# Altium schematic sheet Connector - Carrier.SchDoc
size A4; SheetNumber: 8; SheetTotal: 8
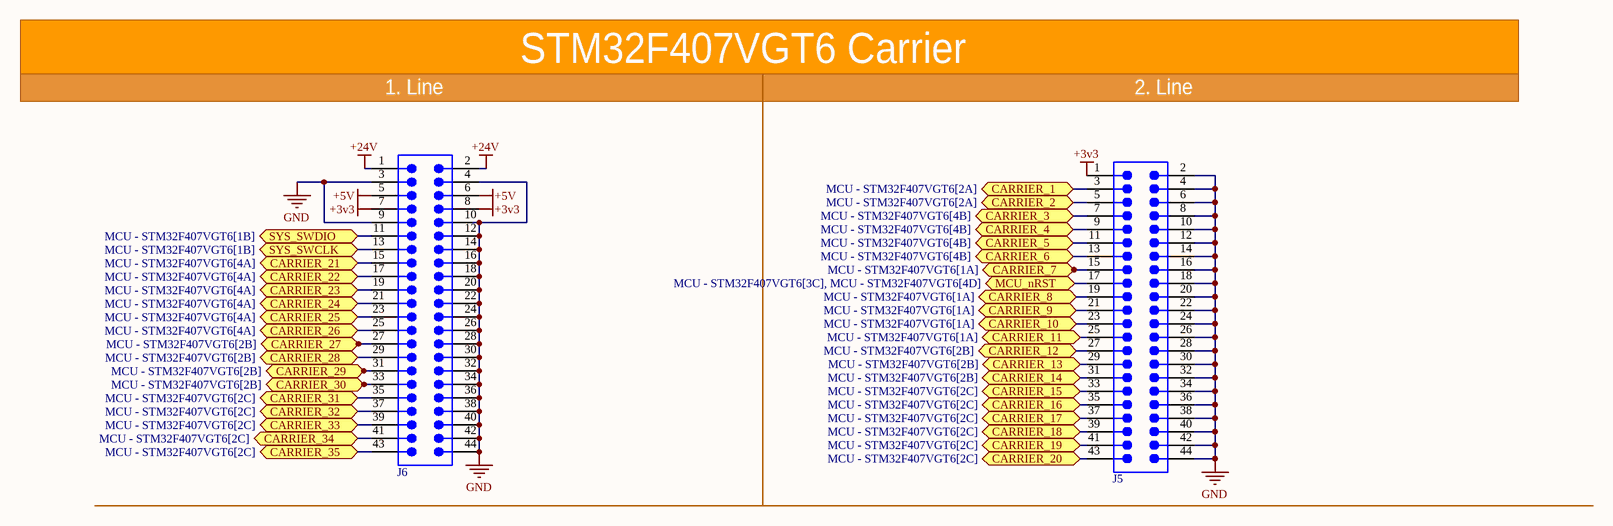
[diagram p0: Connector - Carrier.SchDoc]

## Parts
J5  62004421121  [62004421121]  (value not drawn)
J6  62004421121  [62004421121]  (value not drawn)

## Ports
CARRIER_1 (bidir, see MCU - STM32F407VGT6[2A]), CARRIER_2 (bidir, see MCU - STM32F407VGT6[2A]), CARRIER_3 (bidir, see MCU - STM32F407VGT6[4B]), CARRIER_4 (bidir, see MCU - STM32F407VGT6[4B]), CARRIER_5 (bidir, see MCU - STM32F407VGT6[4B]), CARRIER_6 (bidir, see MCU - STM32F407VGT6[4B]), CARRIER_7 (bidir, see MCU - STM32F407VGT6[1A]), CARRIER_8 (bidir, see MCU - STM32F407VGT6[1A]), CARRIER_9 (bidir, see MCU - STM32F407VGT6[1A]), CARRIER_10 (bidir, see MCU - STM32F407VGT6[1A]), CARRIER_11 (bidir, see MCU - STM32F407VGT6[1A]), CARRIER_12 (bidir, see MCU - STM32F407VGT6[2B]), CARRIER_13 (bidir, see MCU - STM32F407VGT6[2B]), CARRIER_14 (bidir, see MCU - STM32F407VGT6[2B]), CARRIER_15 (bidir, see MCU - STM32F407VGT6[2C]), CARRIER_16 (bidir, see MCU - STM32F407VGT6[2C]), CARRIER_17 (bidir, see MCU - STM32F407VGT6[2C]), CARRIER_18 (bidir, see MCU - STM32F407VGT6[2C]), CARRIER_19 (bidir, see MCU - STM32F407VGT6[2C]), CARRIER_20 (bidir, see MCU - STM32F407VGT6[2C]), CARRIER_21 (bidir, see MCU - STM32F407VGT6[4A]), CARRIER_22 (bidir, see MCU - STM32F407VGT6[4A]), CARRIER_23 (bidir, see MCU - STM32F407VGT6[4A]), CARRIER_24 (bidir, see MCU - STM32F407VGT6[4A]), CARRIER_25 (bidir, see MCU - STM32F407VGT6[4A]), CARRIER_26 (bidir, see MCU - STM32F407VGT6[4A]), CARRIER_27 (bidir, see MCU - STM32F407VGT6[2B]), CARRIER_28 (bidir, see MCU - STM32F407VGT6[2B]), CARRIER_29 (bidir, see MCU - STM32F407VGT6[2B]), CARRIER_30 (bidir, see MCU - STM32F407VGT6[2B]), CARRIER_31 (bidir, see MCU - STM32F407VGT6[2C]), CARRIER_32 (bidir, see MCU - STM32F407VGT6[2C]), CARRIER_33 (bidir, see MCU - STM32F407VGT6[2C]), CARRIER_34 (bidir, see MCU - STM32F407VGT6[2C]), CARRIER_35 (bidir, see MCU - STM32F407VGT6[2C]), MCU_nRST (bidir, see MCU - STM32F407VGT6[3C], MCU - STM32F407VGT6[4D]), SYS_SWCLK (bidir, see MCU - STM32F407VGT6[1B]), SYS_SWDIO (bidir, see MCU - STM32F407VGT6[1B])

## Nets
+3v3: J5.1 J6.7 J6.8
+5V: J6.5 J6.6
+24V: J6.1 J6.2
GND: J5.2 J5.4 J5.6 J5.8 J5.10 J5.12 J5.14 J5.16 J5.18 J5.20 J5.22 J5.24 J5.26 J5.28 J5.30 J5.32 J5.34 J5.36 J5.38 J5.40 J5.42 J5.44 J6.3 J6.4 J6.9 J6.10 J6.12 J6.14 J6.16 J6.18 J6.20 J6.22 J6.24 J6.26 J6.28 J6.30 J6.32 J6.34 J6.36 J6.38 J6.40 J6.42 J6.44
CARRIER_1: J5.3 ; port CARRIER_1
CARRIER_2: J5.5 ; port CARRIER_2
CARRIER_3: J5.7 ; port CARRIER_3
CARRIER_4: J5.9 ; port CARRIER_4
CARRIER_5: J5.11 ; port CARRIER_5
CARRIER_6: J5.13 ; port CARRIER_6
CARRIER_7: J5.15 ; port CARRIER_7
CARRIER_8: J5.19 ; port CARRIER_8
CARRIER_9: J5.21 ; port CARRIER_9
CARRIER_10: J5.23 ; port CARRIER_10
CARRIER_11: J5.25 ; port CARRIER_11
CARRIER_12: J5.27 ; port CARRIER_12
CARRIER_13: J5.29 ; port CARRIER_13
CARRIER_14: J5.31 ; port CARRIER_14
CARRIER_15: J5.33 ; port CARRIER_15
CARRIER_16: J5.35 ; port CARRIER_16
CARRIER_17: J5.37 ; port CARRIER_17
CARRIER_18: J5.39 ; port CARRIER_18
CARRIER_19: J5.41 ; port CARRIER_19
CARRIER_20: J5.43 ; port CARRIER_20
CARRIER_21: J6.15 ; port CARRIER_21
CARRIER_22: J6.17 ; port CARRIER_22
CARRIER_23: J6.19 ; port CARRIER_23
CARRIER_24: J6.21 ; port CARRIER_24
CARRIER_25: J6.23 ; port CARRIER_25
CARRIER_26: J6.25 ; port CARRIER_26
CARRIER_27: J6.27 ; port CARRIER_27
CARRIER_28: J6.29 ; port CARRIER_28
CARRIER_29: J6.31 ; port CARRIER_29
CARRIER_30: J6.33 ; port CARRIER_30
CARRIER_31: J6.35 ; port CARRIER_31
CARRIER_32: J6.37 ; port CARRIER_32
CARRIER_33: J6.39 ; port CARRIER_33
CARRIER_34: J6.41 ; port CARRIER_34
CARRIER_35: J6.43 ; port CARRIER_35
MCU_nRST: J5.17 ; port MCU_nRST
SYS_SWCLK: J6.13 ; port SYS_SWCLK
SYS_SWDIO: J6.11 ; port SYS_SWDIO

## Notes on the sheet
- 1. Line
- STM32F407VGT6 Carrier
- 2. Line

## Library data of the parts
J5 J6 = 62004421121: WR-PHD Pin Header, THT, Vertical, pitch 2mm, 2 Row, 44P; Manufacturer: Wurth Elektronik; Contact Resistance: 20mOhm; Rated Current: 2A; Working Voltage: 200V; Withstanding Voltage: 500V; Manufacturer Part Number: 62004421121; Category: Board-to-Board Connectors; Match Code: WR-PHD; ComponentLink1Description: Website Link; ComponentLink1URL: https://www.we-online.com/redexpert/article/62004421121?ad; ComponentLink2Description: Datasheet Link; ComponentLink2URL: https://www.we-online.com/redexpert/spec/62004421121?ad; Mount: Through Hole; Operating Temperature Max: 105°C; Operating Temperature Min: -40°C; Packaging: Bag; Gender: Pin Header; Number of Pins: 44; Number of Rows: 2; Orientation: Vertical; Pitch: 2mm